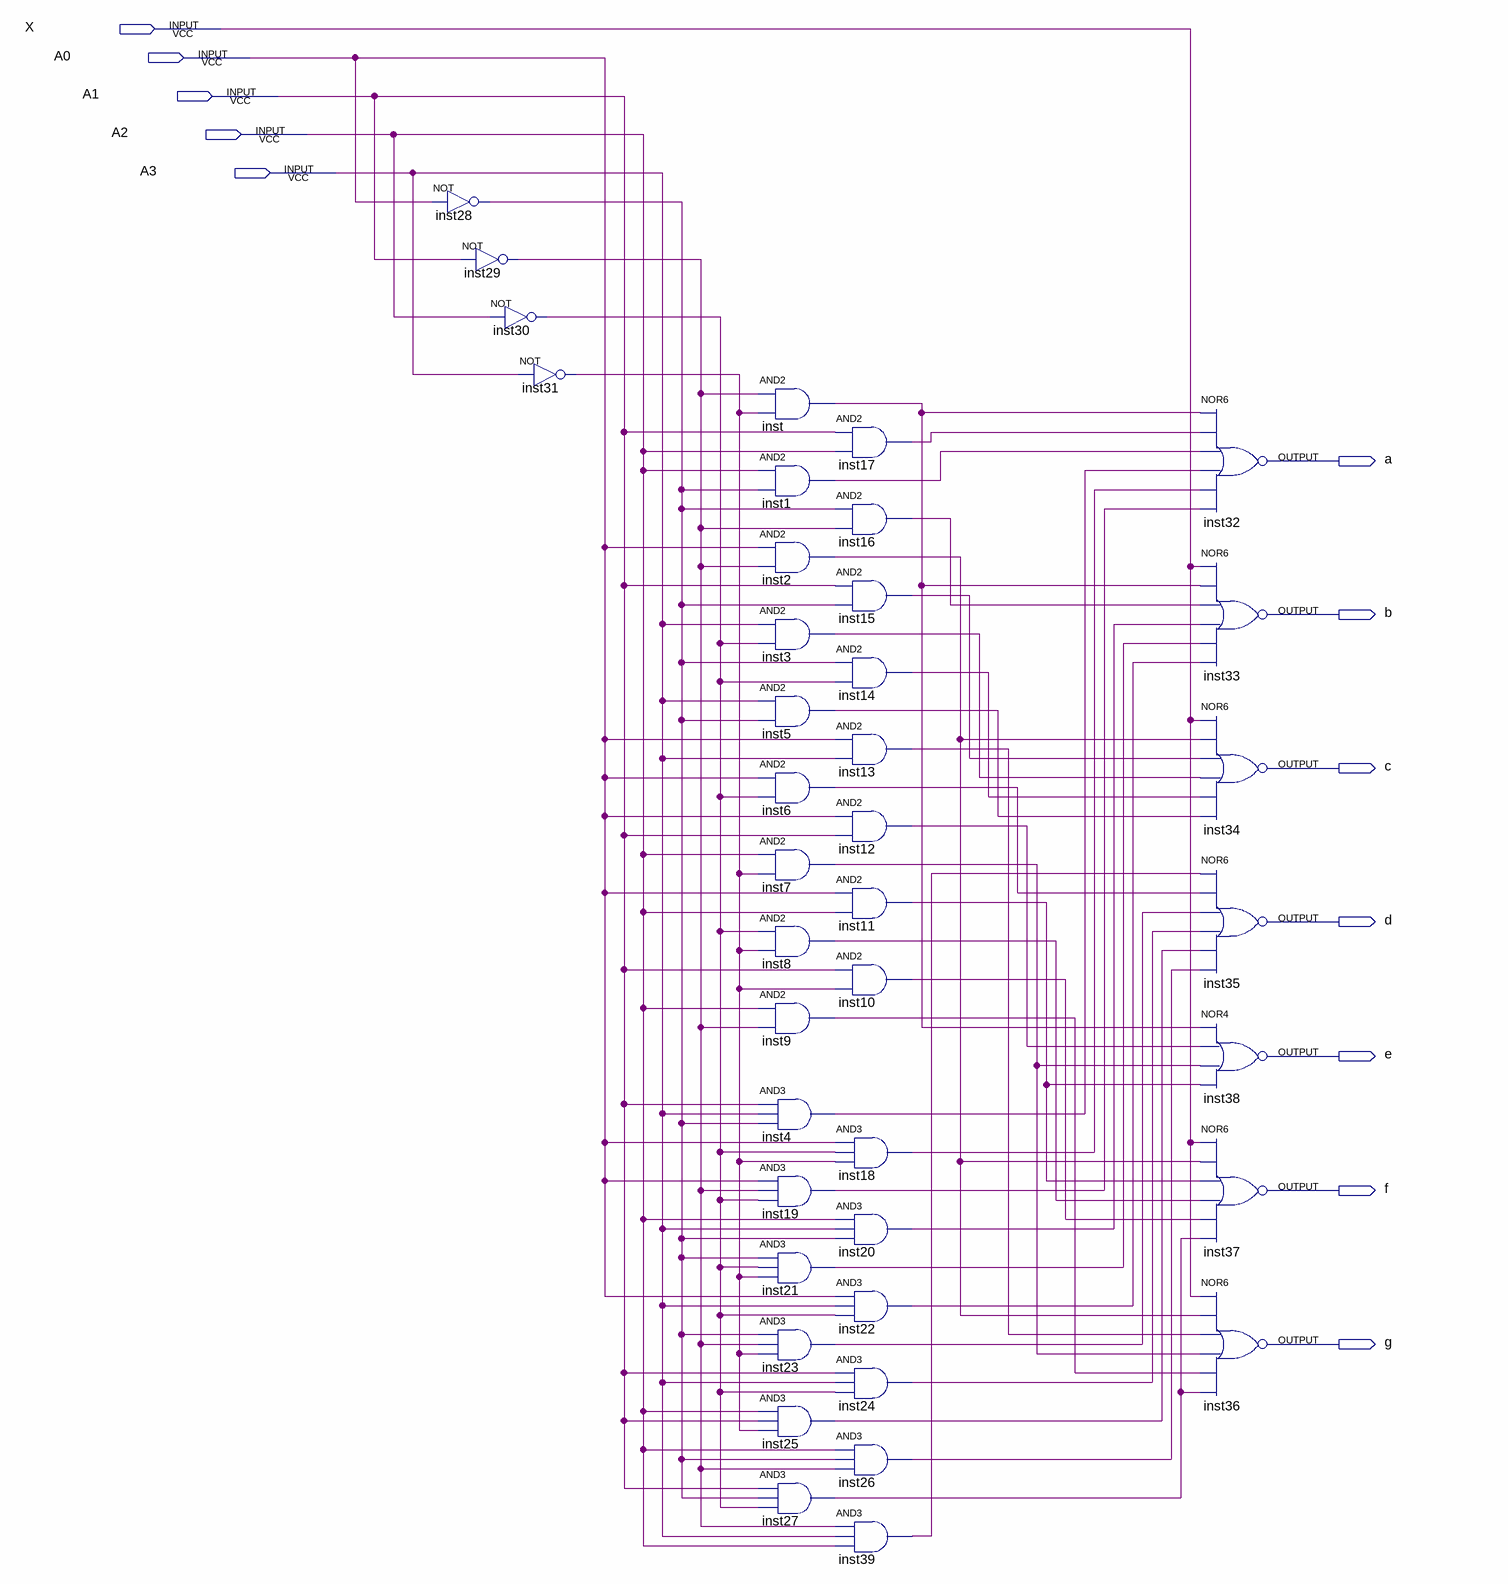
[diagram p0: schematic sheet]
// Quartus schematic ECE_272_Lab_3.bdf as structural Verilog: 40 symbols, 12 pins
module ECE_272_Lab_3 (
  input  X,
  input  A0,
  input  A1,
  input  A2,
  input  A3,
  output a,
  output b,
  output c,
  output d,
  output e,
  output f,
  output g
);

  wire inst1_out, inst2_out, inst3_out, inst4_out, inst5_out, inst6_out, inst7_out, inst8_out, inst9_out,
       inst10_out, inst11_out, inst12_out, inst13_out, inst14_out, inst15_out, inst16_out, inst17_out,
       inst18_out, inst19_out, inst20_out, inst21_out, inst22_out, inst23_out, inst24_out, inst25_out,
       inst26_out, inst27_out, inst28_out, inst29_out, inst30_out, inst31_out, inst39_out, inst_out;

  not inst28 (inst28_out, A0);
  not inst29 (inst29_out, A1);
  not inst30 (inst30_out, A2);
  not inst31 (inst31_out, A3);
  and inst (inst_out, inst29_out, inst31_out);
  and inst1 (inst1_out, A2, inst28_out);
  and inst2 (inst2_out, A0, inst29_out);
  and inst3 (inst3_out, A3, inst30_out);
  and inst5 (inst5_out, A3, inst28_out);
  and inst6 (inst6_out, A0, inst30_out);
  and inst7 (inst7_out, A2, inst31_out);
  and inst8 (inst8_out, inst30_out, inst31_out);
  and inst9 (inst9_out, A2, inst29_out);
  and inst4 (inst4_out, A1, A3, inst28_out);
  and inst19 (inst19_out, A0, inst29_out, inst30_out);
  and inst21 (inst21_out, inst28_out, inst30_out, inst31_out);
  and inst23 (inst23_out, inst28_out, inst29_out, inst31_out);
  and inst25 (inst25_out, A2, A1, inst31_out);
  and inst27 (inst27_out, A1, inst28_out, inst30_out);
  and inst17 (inst17_out, A1, A2);
  and inst16 (inst16_out, inst28_out, inst29_out);
  and inst15 (inst15_out, A1, inst28_out);
  and inst14 (inst14_out, inst28_out, inst30_out);
  and inst13 (inst13_out, A0, A3);
  and inst12 (inst12_out, A0, A1);
  and inst11 (inst11_out, A0, A2);
  and inst10 (inst10_out, A1, inst31_out);
  and inst18 (inst18_out, A0, inst30_out, inst31_out);
  and inst20 (inst20_out, A2, A3, inst28_out);
  and inst22 (inst22_out, A0, A3, inst30_out);
  and inst24 (inst24_out, A1, A3, inst30_out);
  and inst26 (inst26_out, A2, inst28_out, inst29_out);
  and inst39 (inst39_out, inst29_out, A3, A2);
  nor inst32 (a, inst_out, inst17_out, inst1_out, inst4_out, inst18_out, inst19_out);
  nor inst33 (b, X, inst_out, inst16_out, inst20_out, inst21_out, inst22_out);
  nor inst34 (c, X, inst2_out, inst15_out, inst3_out, inst14_out, inst5_out);
  nor inst35 (d, inst39_out, inst6_out, inst23_out, inst24_out, inst25_out, inst26_out);
  nor inst38 (e, inst_out, inst12_out, inst7_out, inst11_out);
  nor inst37 (f, X, inst2_out, inst11_out, inst8_out, inst10_out, inst27_out);
  nor inst36 (g, X, inst2_out, inst13_out, inst7_out, inst9_out, inst27_out);
endmodule
